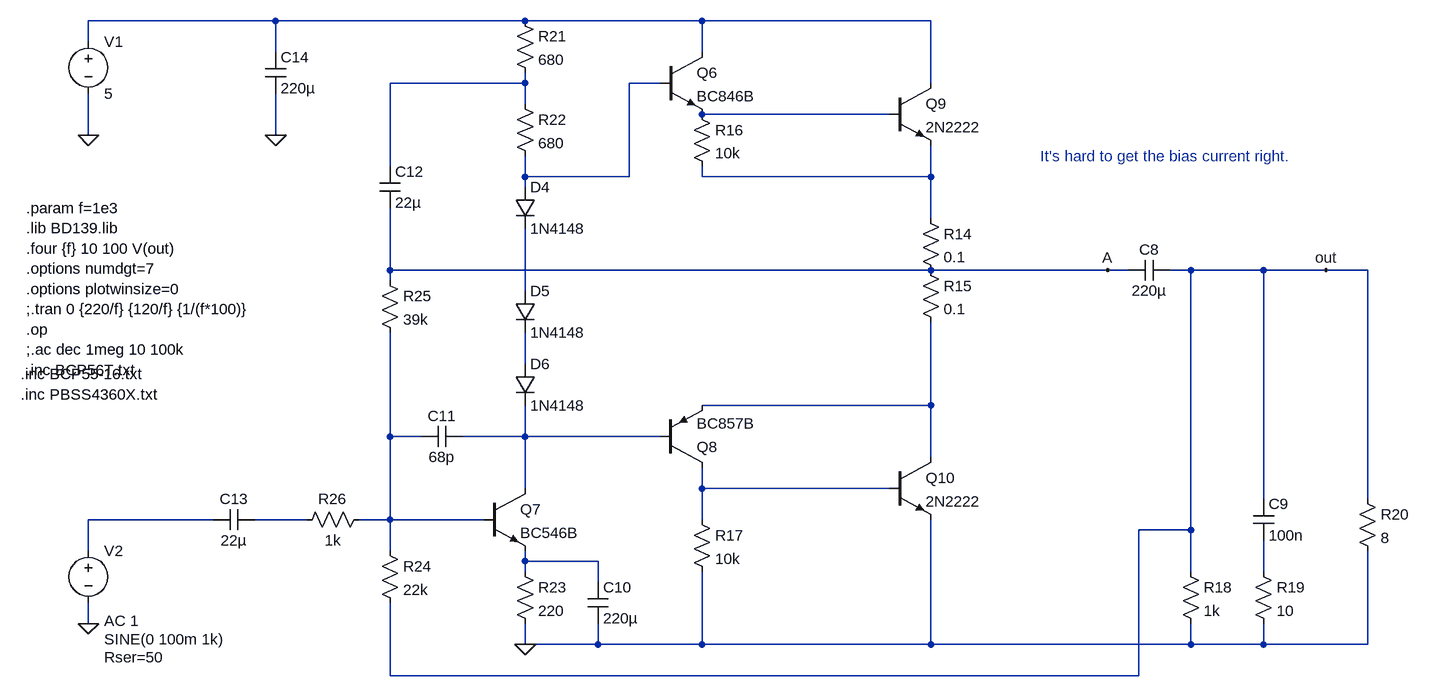
[diagram p0: schematic sound-au_project178_5V-BCP56T.asc]
sound-au_project178_5V-BCP56T.asc, the LTspice schematic file:
Version 4
SHEET 1 2660 680
WIRE 912 -544 624 -544
WIRE 1296 -544 912 -544
WIRE 1568 -544 1296 -544
WIRE 1920 -544 1568 -544
WIRE 624 -512 624 -544
WIRE 912 -496 912 -544
WIRE 1568 -496 1568 -544
WIRE 1296 -448 1296 -464
WIRE 1296 -448 1088 -448
WIRE 1504 -448 1456 -448
WIRE 1920 -448 1920 -544
WIRE 1296 -416 1296 -448
WIRE 1856 -400 1568 -400
WIRE 624 -368 624 -432
WIRE 912 -368 912 -432
WIRE 1088 -320 1088 -448
WIRE 1296 -304 1296 -336
WIRE 1456 -304 1456 -448
WIRE 1456 -304 1296 -304
WIRE 1568 -304 1568 -320
WIRE 1920 -304 1920 -352
WIRE 1920 -304 1568 -304
WIRE 1296 -288 1296 -304
WIRE 1920 -240 1920 -304
WIRE 1088 -160 1088 -256
WIRE 1920 -160 1088 -160
WIRE 2192 -160 1920 -160
WIRE 2224 -160 2192 -160
WIRE 2320 -160 2288 -160
WIRE 2432 -160 2320 -160
WIRE 2528 -160 2432 -160
WIRE 2592 -160 2528 -160
WIRE 1088 -144 1088 -160
WIRE 1296 -128 1296 -224
WIRE 1296 -16 1296 -64
WIRE 1920 48 1920 -80
WIRE 1920 48 1568 48
WIRE 1088 96 1088 -64
WIRE 1136 96 1088 96
WIRE 1296 96 1296 48
WIRE 1296 96 1200 96
WIRE 1504 96 1296 96
WIRE 1920 128 1920 48
WIRE 1296 176 1296 96
WIRE 1568 176 1568 144
WIRE 1856 176 1568 176
WIRE 2432 192 2432 -160
WIRE 2592 192 2592 -160
WIRE 816 224 624 224
WIRE 960 224 880 224
WIRE 1088 224 1088 96
WIRE 1088 224 1040 224
WIRE 1232 224 1088 224
WIRE 1568 224 1568 176
WIRE 2320 240 2320 -160
WIRE 2320 240 2240 240
WIRE 624 272 624 224
WIRE 1088 272 1088 224
WIRE 1296 288 1296 272
WIRE 1408 288 1296 288
WIRE 1296 304 1296 288
WIRE 2320 304 2320 240
WIRE 2432 304 2432 256
WIRE 1408 320 1408 288
WIRE 624 384 624 352
WIRE 1296 416 1296 384
WIRE 1408 416 1408 384
WIRE 1408 416 1296 416
WIRE 1568 416 1568 304
WIRE 1568 416 1408 416
WIRE 1920 416 1920 224
WIRE 1920 416 1568 416
WIRE 2320 416 2320 384
WIRE 2320 416 1920 416
WIRE 2432 416 2432 384
WIRE 2432 416 2320 416
WIRE 2592 416 2592 272
WIRE 2592 416 2432 416
WIRE 1088 464 1088 352
WIRE 2240 464 2240 240
WIRE 2240 464 1088 464
FLAG 624 384 0
FLAG 624 -368 0
FLAG 2192 -160 A
FLAG 1296 416 0
FLAG 2528 -160 out
FLAG 912 -368 0
DATAFLAG 2080 -160 ""
DATAFLAG 1392 -304 ""
DATAFLAG 1792 -400 ""
DATAFLAG 1440 96 ""
DATAFLAG 1712 176 ""
DATAFLAG 1168 224 ""
DATAFLAG 1408 288 ""
SYMBOL npn 1504 -496 R0
SYMATTR InstName Q6
SYMATTR Value BC846B
SYMBOL npn 1232 176 R0
SYMATTR InstName Q7
SYMATTR Value BC546B
SYMBOL pnp 1504 144 M180
SYMATTR InstName Q8
SYMATTR Value BC857B
SYMBOL res 1904 -256 R0
SYMATTR InstName R14
SYMATTR Value 0.1
SYMBOL res 1904 -176 R0
SYMATTR InstName R15
SYMATTR Value 0.1
SYMBOL res 1552 -416 R0
SYMATTR InstName R16
SYMATTR Value 10k
SYMBOL res 1552 208 R0
SYMATTR InstName R17
SYMATTR Value 10k
SYMBOL cap 2288 -176 R90
WINDOW 0 0 32 VBottom 2
WINDOW 3 32 32 VTop 2
SYMATTR InstName C8
SYMATTR Value 220µ
SYMBOL res 2304 288 R0
SYMATTR InstName R18
SYMATTR Value 1k
SYMBOL res 2416 288 R0
SYMATTR InstName R19
SYMATTR Value 10
SYMBOL cap 2416 192 R0
SYMATTR InstName C9
SYMATTR Value 100n
SYMBOL res 2576 176 R0
SYMATTR InstName R20
SYMATTR Value 8
SYMBOL res 1280 -560 R0
SYMATTR InstName R21
SYMATTR Value 680
SYMBOL res 1280 -432 R0
SYMATTR InstName R22
SYMATTR Value 680
SYMBOL res 1280 288 R0
SYMATTR InstName R23
SYMATTR Value 220
SYMBOL cap 1392 320 R0
SYMATTR InstName C10
SYMATTR Value 220µ
SYMBOL cap 1200 80 R90
WINDOW 0 0 32 VBottom 2
WINDOW 3 32 32 VTop 2
SYMATTR InstName C11
SYMATTR Value 68p
SYMBOL res 1072 256 R0
SYMATTR InstName R24
SYMATTR Value 22k
SYMBOL res 1072 -160 R0
SYMATTR InstName R25
SYMATTR Value 39k
SYMBOL cap 1072 -320 R0
SYMATTR InstName C12
SYMATTR Value 22µ
SYMBOL res 1056 208 R90
WINDOW 0 0 56 VBottom 2
WINDOW 3 32 56 VTop 2
SYMATTR InstName R26
SYMATTR Value 1k
SYMBOL cap 880 208 R90
WINDOW 0 0 32 VBottom 2
WINDOW 3 32 32 VTop 2
SYMATTR InstName C13
SYMATTR Value 22µ
SYMBOL voltage 624 -528 R0
SYMATTR InstName V1
SYMATTR Value 5
SYMBOL voltage 624 256 R0
WINDOW 3 24 152 Left 2
WINDOW 123 24 124 Left 2
WINDOW 39 24 180 Left 2
SYMATTR Value SINE(0 100m 1k)
SYMATTR Value2 AC 1
SYMATTR SpiceLine Rser=50
SYMATTR InstName V2
SYMBOL cap 896 -496 R0
SYMATTR InstName C14
SYMATTR Value 220µ
SYMBOL diode 1280 -288 R0
SYMATTR InstName D4
SYMATTR Value 1N4148
SYMBOL diode 1280 -128 R0
SYMATTR InstName D5
SYMATTR Value 1N4148
SYMBOL diode 1280 -16 R0
SYMATTR InstName D6
SYMATTR Value 1N4148
SYMBOL npn 1856 -448 R0
SYMATTR InstName Q9
SYMATTR Value 2N2222
SYMBOL npn 1856 128 R0
SYMATTR InstName Q10
SYMATTR Value 2N2222
TEXT 528 -256 Left 2 !.param f=1e3\n.lib BD139.lib\n.four {f} 10 100 V(out)\n.options numdgt=7\n.options plotwinsize=0\n;.tran 0 {220/f} {120/f} {1/(f*100)}\n.op\n;.ac dec 1meg 10 100k\n.inc BCP56T.txt
TEXT 520 0 Left 2 !.inc BCP55-16.txt\n.inc PBSS4360X.txt
TEXT 2088 -336 Left 2 ;It's hard to get the bias current right.

The netlist it stands for:
* sound-au_project178_5V-BCP56T.asc
Q6 N001 N003 N004 0 BC846B
Q7 N010 N009 N014 0 BC546B
Q8 N011 N010 N008 0 BC857B
R14 N005 A 0.1
R15 A N008 0.1
R16 N004 N005 10k
R17 N011 0 10k
C8 out A 220µ
R18 out 0 1k
R19 N015 0 10
C9 out N015 100n
R20 out 0 8
R21 N001 N002 680
R22 N002 N003 680
R23 N014 0 220
C10 N014 0 220µ
C11 N010 N009 68p
R24 N009 out 22k
R25 A N009 39k
C12 N002 A 22µ
R26 N009 N013 1k
C13 N013 N012 22µ
V1 N001 0 5
V2 N012 0 SINE(0 100m 1k) AC 1 Rser=50
C14 N001 0 220µ
D4 N003 N006 1N4148
D5 N006 N007 1N4148
D6 N007 N010 1N4148
Q9 N001 N004 N005 0 2N2222
Q10 N008 N011 0 0 2N2222
.model D D
.lib standard.dio
.model NPN NPN
.model PNP PNP
.lib standard.bjt
.param f=1e3
.lib BD139.lib
.four {f} 10 100 V(out)
.options numdgt=7
.options plotwinsize=0
;.tran 0 {220/f} {120/f} {1/(f*100)}
.op
;.ac dec 1meg 10 100k
.inc BCP56T.txt
.inc BCP55-16.txt
.inc PBSS4360X.txt
* It's hard to get the bias current right.
.backanno
.end